# EAGLE design avga_final (EAGLE 7.5.0)
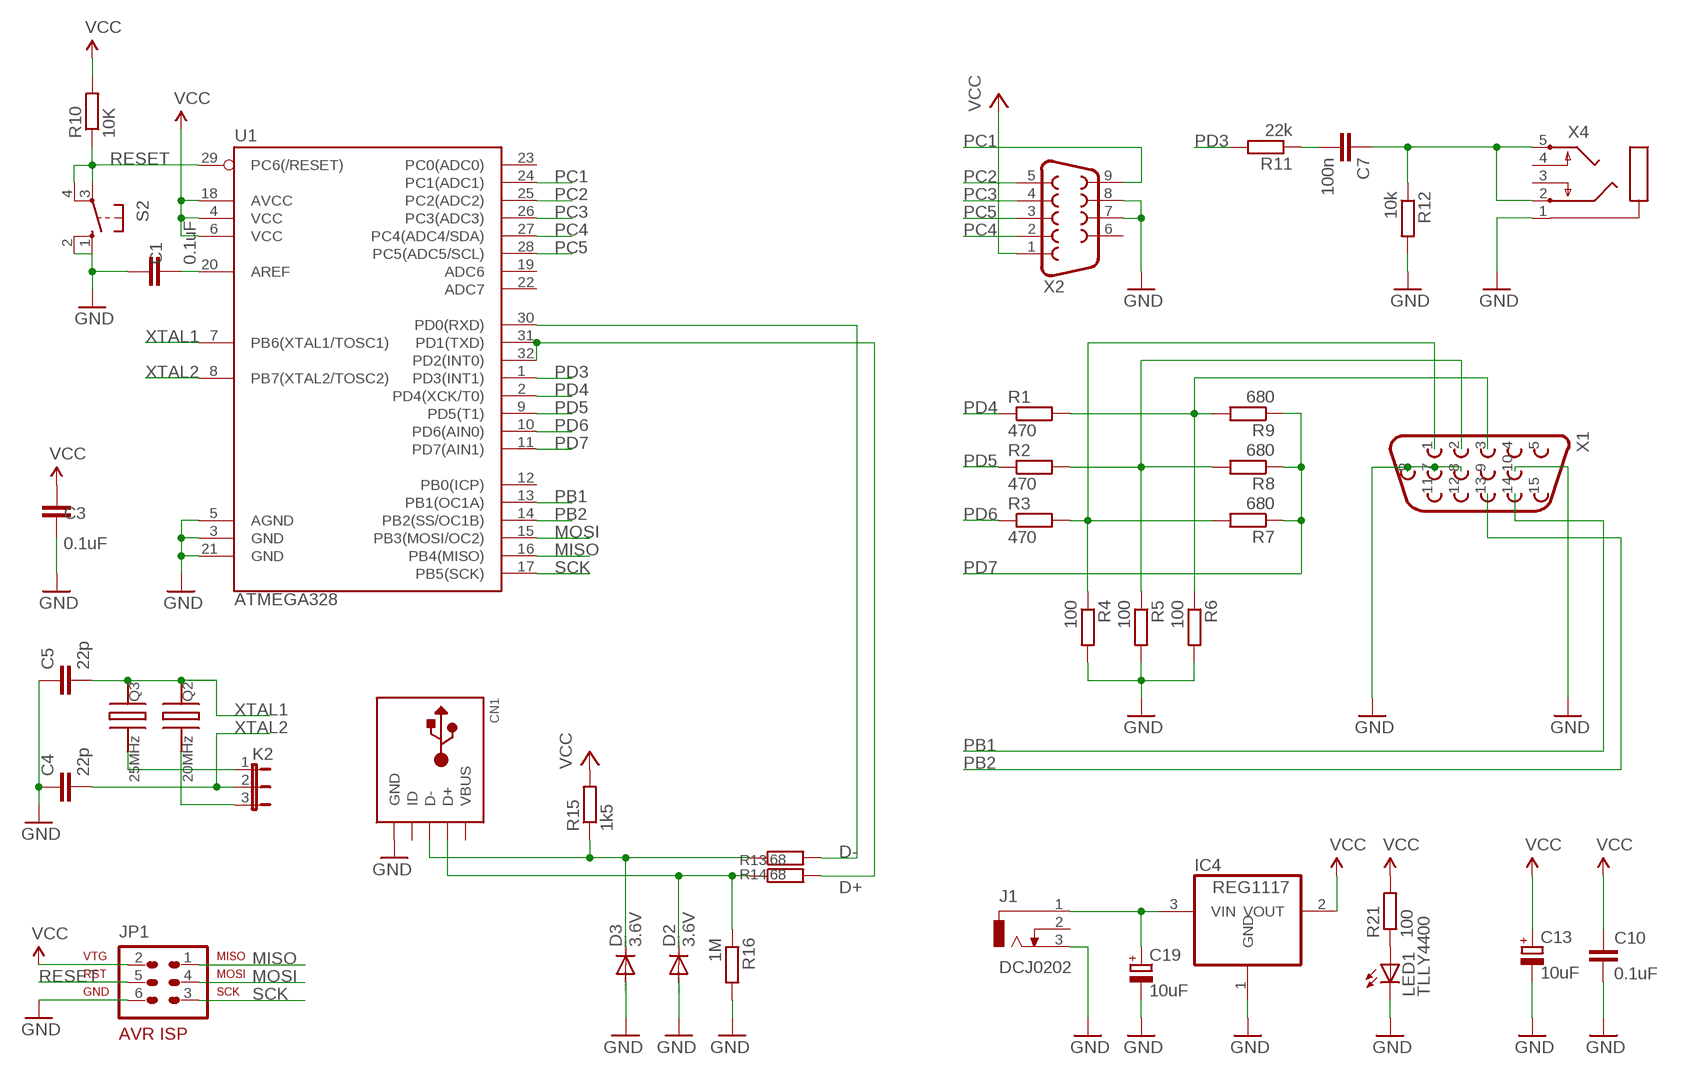
[diagram p0: schematic, sheet 1]

## Parts
C1  0.1uF  C-EUC0805  [C0805]
C3  0.1uF  C-EUC0805  [C0805]
C4  22p  C-EUC0805  [C0805]
C5  22p  C-EUC0805  [C0805]
C7  100n  C-EUC0805  [C0805]
C10  0.1uF  C-EUC0805  [C0805]
C13  10uF  CPOL-EUE2.5-5  [E2,5-5]
C19  10uF  CPOL-EUE2.5-5  [E2,5-5]
CN1  USBMINIB  [USB-MINIB]
D2  3.6V  DIODE-MINIMELF  [MINIMELF]
D3  3.6V  DIODE-MINIMELF  [MINIMELF]
IC4  REG1117  [SOT223]
J1  DCJ0202  [DCJ0202]
JP1  AVR-ISP-6R  [AVR-ISP-6R]
K2  CON-3-POL  [MOLEX-PSK-03]
LED1  TLLY4400  [LED3MM]
Q2  20MHz  QUARZ  [QUARZ]
Q3  25MHz  QUARZ  [QUARZ]
R1  470  R-EU_R0805  [R0805]
R2  470  R-EU_R0805  [R0805]
R3  470  R-EU_R0805  [R0805]
R4  100  R-EU_R0805  [R0805]
R5  100  R-EU_R0805  [R0805]
R6  100  R-EU_R0805  [R0805]
R7  680  R-EU_R0805  [R0805]
R8  680  R-EU_R0805  [R0805]
R9  680  R-EU_R0805  [R0805]
R10  10K  R-EU_R0805  [R0805]
R11  22k  R-EU_R0805  [R0805]
R12  10k  R-EU_R0805  [R0805]
R13  68  R-EU_R0805  [R0805]
R14  68  R-EU_R0805  [R0805]
R15  1k5  R-EU_R0805  [R0805]
R16  1M  R-EU_R0805  [R0805]
R21  100  R-EU_R0805  [R0805]
S2  10-XX  [B3F-10XX]
U1  ATMEGA328  ATMEGA168  [TQFP32-08]
X1  VGA-BU-15POL  [VGA-BU-15POL]
X2  D-SUB-ST-9POL  [M09HP]
X4  KLINKENBUCHSE  [KLINKENBUCHSE]

## Nets
B: R1.2 R6.1 R9.2 X1.3
G: R2.2 R5.1 R8.2 X1.2
GND: C1.2 C3.1 C4.1 C5.1 C10.2 C13.- C19.- CN1.GND D2.A D3.A IC4.1(GND) J1.3 JP1.6 LED1.K(C) R4.2 R5.2 R6.2 R12.2 R16.2 S2.1(S) S2.2(S1) U1.3(GND) U1.5(AGND) U1.21(GND) X1.6 X1.7 X1.8 X1.10 X2.7 X2.8 X4.1
MISO: JP1.1 U1.16(PB4(MISO))
MOSI: JP1.4 U1.15(PB3(MOSI/OC2))
N$1: LED1.A R21.1
N$2: C7.1 R12.1 X4.2 X4.5
N$3: K2.1 Q3.2
N$6: C1.1 U1.20(AREF)
N$11: CN1.D+ D2.C R13.1 R16.1
N$13: CN1.D- D3.C R14.1 R15.1
N$14: C7.2 R11.1
N$15: R13.2 U1.31(PD1(TXD)) U1.32(PD2(INT0))
N$16: R14.2 U1.30(PD0(RXD))
N$19: K2.3 Q2.2
PB1: U1.13(PB1(OC1A)) X1.14
PB2: U1.14(PB2(SS/OC1B)) X1.13
PC1: U1.24(PC1(ADC1)) X2.9
PC2: U1.25(PC2(ADC2)) X2.5
PC3: U1.26(PC3(ADC3)) X2.4
PC4: U1.27(PC4(ADC4/SDA)) X2.2
PC5: U1.28(PC5(ADC5/SCL)) X2.3
PD3: R11.2 U1.1(PD3(INT1))
PD4: R1.1 U1.2(PD4(XCK/T0))
PD5: R2.1 U1.9(PD5(T1))
PD6: R3.1 U1.10(PD6(AIN0))
PD7: R7.1 R8.1 R9.1 U1.11(PD7(AIN1))
R: R3.2 R4.1 R7.2 X1.1
RESET: JP1.5 R10.1 S2.3(P) S2.4(P1) U1.29(PC6(/RESET))
SCK: JP1.3 U1.17(PB5(SCK))
VCC: C3.2 C10.1 C13.+ IC4.2(VOUT) JP1.2 R10.2 R15.2 R21.2 U1.4(VCC) U1.6(VCC) U1.18(AVCC) X2.1
VIN [vcc]: C19.+ IC4.3(VIN) J1.1
XTAL1: C5.2 Q2.1 Q3.1 U1.7(PB6(XTAL1/TOSC1))
XTAL2: C4.2 K2.2 U1.8(PB7(XTAL2/TOSC2))
Unconnected: CN1.ID J1.2 U1.12(PB0(ICP)) U1.19(ADC6) U1.22(ADC7) U1.23(PC0(ADC0)) X1.4 X1.5 X1.9 X1.11 X1.12 X1.15 X2.6 X4.3 X4.4

## Notes on the sheet
- D-
- D+

## Power pins joined to a net without a drawn wire
VBUS: CN1.VBUS

## Library data of the parts
C1 C3 = resistor:C-EU: CAPACITOR, European symbol
C4 C5 C7 C10 = rcl:C-EU: CAPACITOR, European symbol
C13 C19 = rcl:CPOL-EU: POLARIZED CAPACITOR, European symbol
CN1 = adafruit:USB: USB Connectors USBMINIB - Surface Mount Female Mini-B USB Connector 4UConnector: 06564 By microbuilder.eu Thru-hole RA Female Mini-B USB Connector 4UConnector: 18732 By ladyada.net
D2 D3 = diode:DIODE-: DIODE
IC4 = burr-brown:REG1117: 800mA and 1A Low Dropout (LDO) Positive Regulator 1.8V, 2.5V, 2.85V, 3.3V, 5V, and Adj; MPN: REG1117; OC_FARNELL: 1097566; OC_NEWARK: 14P6981
J1 = con-jack-igi:DCJ0202: DC POWER JACK Source: DCJ0202.pdf; OC_FARNELL: unknown; OC_NEWARK: unknown
JP1 = avr-6:AVR-ISP-6: AVR ISP-6 Serial Programming Header
K2 = usbswitchboard:CON-3-POL: JST Stiftleiste B3B-EH-A
LED1 = led-igi:TLLY4400: Low Current (2mA) LED 3 mm Tinted Diffused Package color YELLOW Source: Data sheet <http://www.farnell.com/datasheets/391098.pdf>; MF: VISHAY SEMICONDUCTOR; OC_FARNELL: 1612439
Q2 Q3 = pacman:QUARZ: Quarz
R1-R9 R11-R16 = rcl:R-EU_: RESISTOR, European symbol
R10 R21 = resistor:R-EU_: RESISTOR, European symbol
S2 = switch-omron:10-XX: OMRON SWITCH; MPN: B3F-1000; OC_FARNELL: 176432; OC_NEWARK: 36M3542
U1 = SparkFun:ATMEGA168
X1 = usbboard:VGA-BU-15POL: VGA-Buchse 15pol
X2 = pacman:D-SUB-ST-9POL: D-SUB-Stecker, 9-polig, gewinkelt, RM 9,4
X4 = usbboard:KLINKENBUCHSE: Klinkenbuchse 3,5mm stereo

## Net classes
1 vcc: width 0.254 mm

## Board
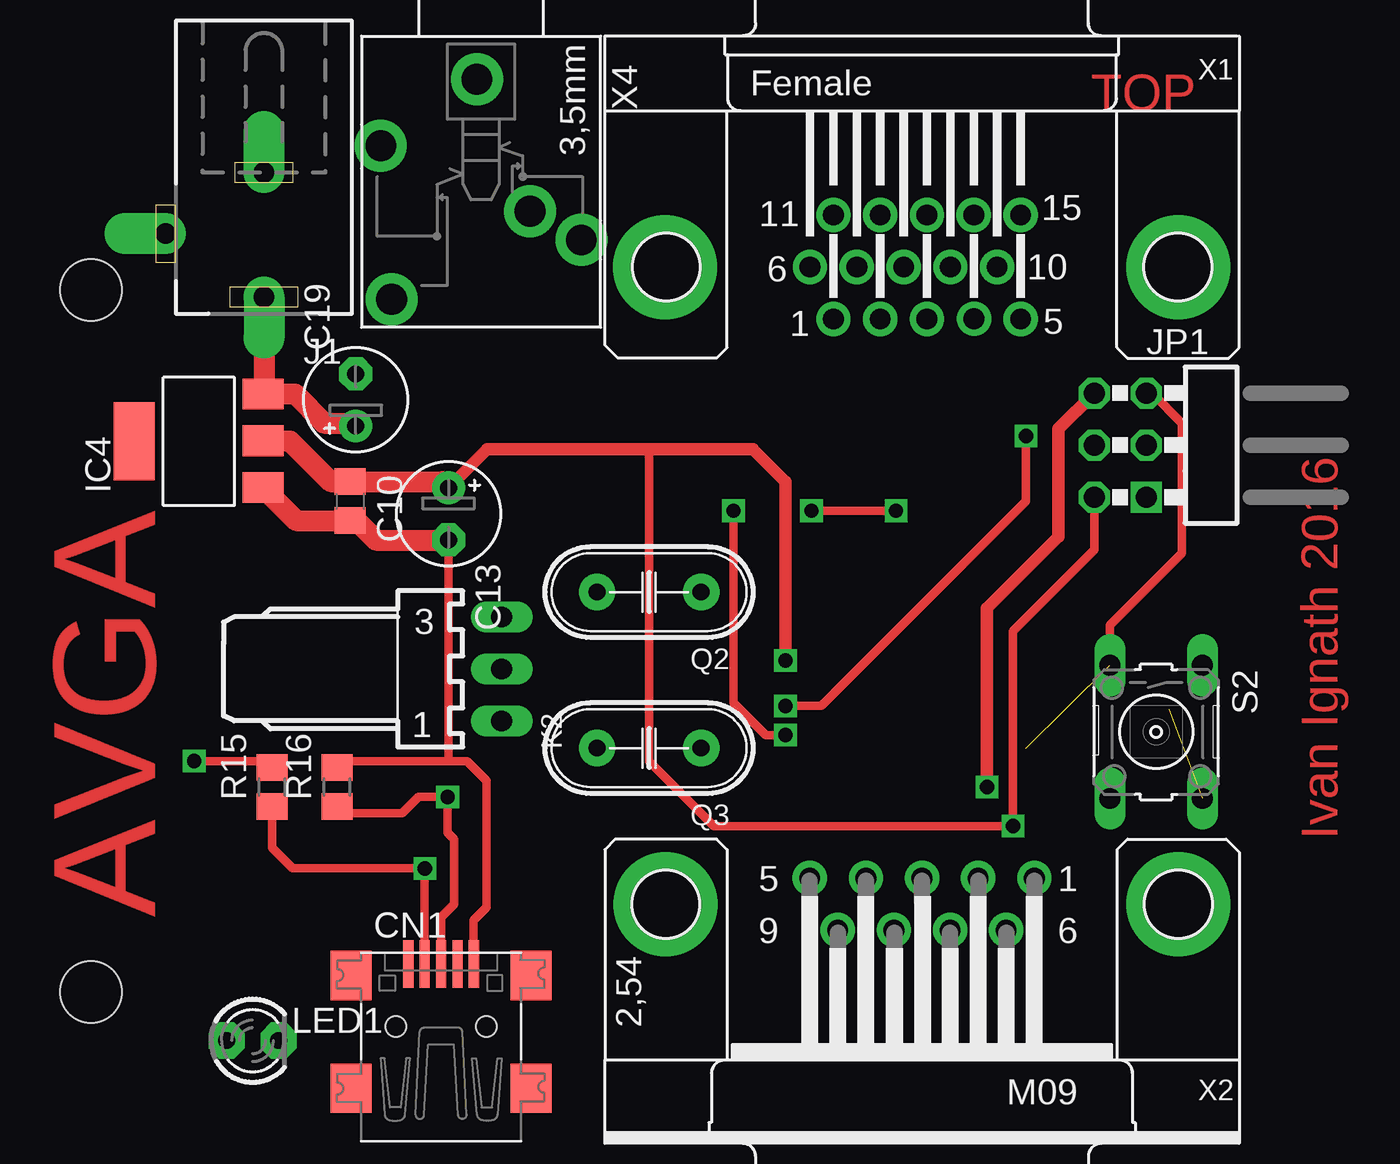
[diagram p1: board, top side]
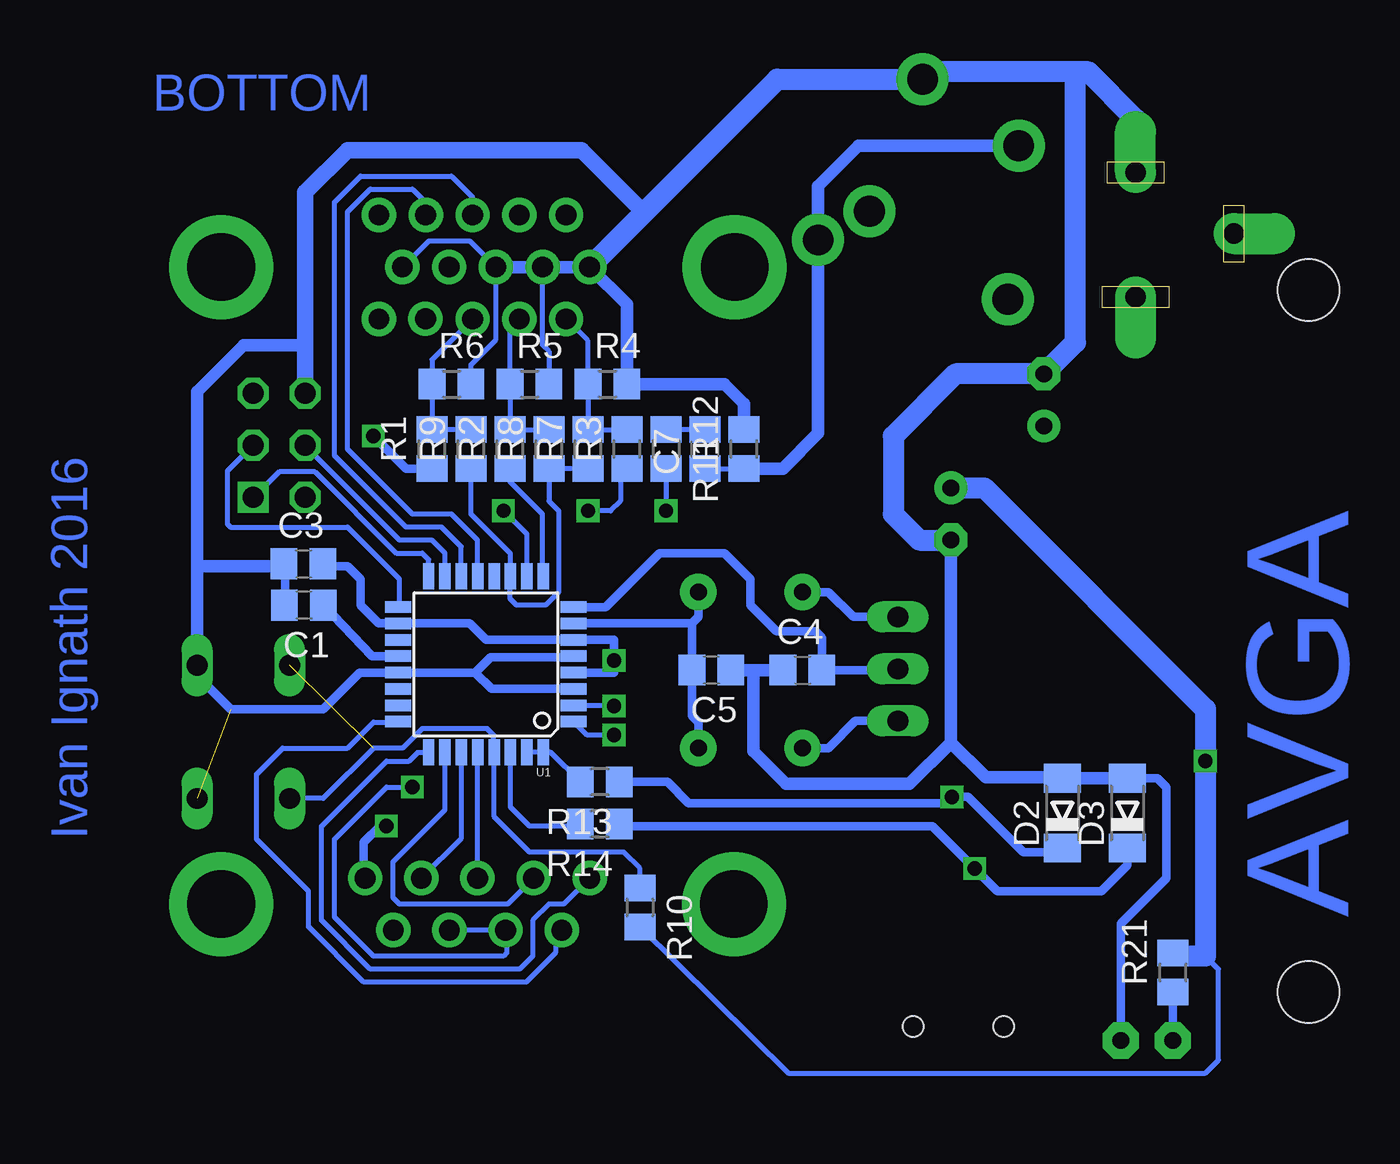
[diagram p2: board, bottom side, seen from below]

No outline drawn. Coordinates in mm, seen from the top.
Copper layers (1*16): Top 0.035mm / dielectric 1.5mm / Bottom 0.035mm
Design rules "default": minimum track width 10mil, minimum drill 24mil, track to track 8mil, track to pad 8mil, pad to pad 8mil, via to via 8mil, smd to smd 8mil, copper to edge 40mil, drill to drill 8mil, minimum pad ring 10mil, minimum via ring 8mil, stop-mask expansion 4mil, vias tented up to drill 0mil, thermal gap 10mil
Holes 3 mm at 77.77,5.87 3.86,5.87 77.77,40.16 3.86,40.16

### Footprints (pad centres in the part's own frame; a part is rotated, then mirrored left to right if it is on the bottom)
C0805 = smd 1.3 x 1.5: 1 -0.95,0; 2 0.95,0
E2,5-5 = drill 0.813 pad 1.6: + -1.27,0 | drill 0.813 pad 1.6 octagon: - 1.27,0
USB-MINIB = smd 0.5 x 2.308: D+ 0,4.064; D- -0.8,4.064; GND 1.6,4.064; ID 0.8,4.064; VBUS -1.6,4.064 | smd 2 x 2.4: GND1 -4.4,-2; GND2 -4.4,3.5; GND3 4.4,3.5; GND4 4.4,-2 | hole 1: -2.2,1; 2.2,1
MINIMELF = smd 1.4 x 1.8: A 1.7,0; C -1.7,0
SOT223 = smd 1.499 x 2.007: 1 -2.261,-3.15; 2 0.025,-3.15; 3 2.311,-3.15 | smd 3.81 x 2.007: 4 0,3.15
DCJ0202 = drill 1 pad 2 offset: 1 0,3.1; 2 4.8,0; 3 0,-3
AVR-ISP-6R = drill 1.016 square: 1 -2.54,-1.27 | drill 1.016 octagon: 2 -2.54,1.27; 3 0,-1.27; 4 0,1.27; 5 2.54,-1.27; 6 2.54,1.27
MOLEX-PSK-03 = drill 1.016 long: 1 2.54,0; 2 0,0; 3 -2.54,0
LED3MM = drill 0.813 pad 1.778 octagon: A -1.27,0; K 1.27,0
QUARZ = drill 0.813 pad 1.778: 1 0,0; 2 5.08,0
R0805 = smd 1.3 x 1.5: 1 -0.95,0; 2 0.95,0
B3F-10XX = drill 1.016 long: 1 -3.251,2.261; 2 3.251,2.261; 3 -3.251,-2.261; 4 3.251,-2.261
TQFP32-08 = smd 1.27 x 0.559: 1 -4.293,2.8; 2 -4.293,2; 3 -4.293,1.2; 4 -4.293,0.4; 5 -4.293,-0.4; 6 -4.293,-1.2; 7 -4.293,-2; 8 -4.293,-2.8; 17 4.293,-2.8; 18 4.293,-2; 19 4.293,-1.2; 20 4.293,-0.4; 21 4.293,0.4; 22 4.293,1.2; 23 4.293,2; 24 4.293,2.8 | smd 0.559 x 1.27: 9 -2.8,-4.293; 10 -2,-4.293; 11 -1.2,-4.293; 12 -0.4,-4.293; 13 0.4,-4.293; 14 1.2,-4.293; 15 2,-4.293; 16 2.8,-4.293; 25 2.8,4.293; 26 2,4.293; 27 1.2,4.293; 28 0.4,4.293; 29 -0.4,4.293; 30 -1.2,4.293; 31 -2,4.293; 32 -2.8,4.293
VGA-BU-15POL = drill 1.016 pad 1.676: 1 4.329,2.54; 2 2.043,2.54; 3 -0.243,2.54; 4 -2.54,2.529; 5 -4.815,2.54; 6 5.472,0; 7 3.186,0; 8 0.9,0; 9 -1.386,0; 10 -3.672,0; 11 4.329,-2.54; 12 2.043,-2.54; 13 -0.243,-2.54; 14 -2.529,-2.54; 15 -4.815,-2.54 | drill 3.302 pad 5.08: G1 -12.522,0; G3 12.56,0
M09HP = drill 1.016 pad 1.676: 1 -5.486,-1.27; 2 -2.743,-1.27; 3 0,-1.27; 4 2.743,-1.27; 5 5.486,-1.27; 6 -4.115,1.27; 7 -1.372,1.27; 8 1.372,1.27; 9 4.115,1.27 | drill 3.302 pad 5.08: G1 -12.522,0; G2 12.522,0
KLINKENBUCHSE = drill 1.499 pad 2.54: 1 -5.004,-0.203; 2 2.845,4.902; 3 1.448,2.388; 4 5.74,-4.369; 5 -1.753,-4.902

### Placement (x,y rotation side)
C1  52.93,24.76 180 bottom
C3  52.95,26.78 0 bottom
C4  28.57,21.59 0 bottom
C5  33.02,21.59 180 bottom
C7  33.34,32.38 90 bottom
C10  16.51,29.84 270 top
C13  21.32,29.22 270 top
C19  16.78,34.79 90 top
CN1  20.95,3.17 0 top
D2  15.88,14.61 90 bottom
D3  12.7,14.61 90 bottom
IC4  9.12,32.76 90 top
J1  12.3,42.9 180 top
JP1  54.13,32.57 90 top
K2  23.92,21.64 270 top
LED1  11.75,3.49 0 top
Q2  33.66,25.4 180 top
Q3  33.66,17.78 180 top
R1  46.67,32.38 90 bottom
R2  42.86,32.38 90 bottom
R3  37.15,32.38 90 bottom
R4  38.1,35.56 0 bottom
R5  41.91,35.56 0 bottom
R6  45.72,35.56 0 bottom
R7  39.05,32.38 90 bottom
R8  40.96,32.38 90 bottom
R9  44.77,32.38 90 bottom
R10  36.51,10 270 bottom
R11  35.24,32.38 270 bottom
R12  31.43,32.38 90 bottom
R13  38.48,16.13 180 bottom
R14  38.47,14.07 180 bottom
R15  12.7,15.88 90 top
R16  15.88,15.88 90 top
R21  10.48,6.83 90 bottom
S2  55.89,18.57 270 top
U1  44.04,21.87 180 bottom
X1  44.45,41.27 180 top
X2  44.45,10.16 180 top
X4  22.91,45.44 270 top

### Tracks (layer width: path | path; a pad name or v marks a point on that pad's centre or on a via)
B
  Bottom 0.254: R9.2 R1.2 R6.1 46.67,36.76 X1.3
G
  Bottom 0.254: R8.2 R2.2 R5.1 42.86,38.28 X1.2
GND  (via drill 0.7 pad 0.25)  (1 unrouted)
  Top 0.406: R16.2 16.2,17.14 21.32,17.14 | CN1.GND 22.54,7.25 22.54,9.37 23.18,10 23.18,16.19 22.23,17.14 21.32,17.14 | 21.32,17.14 C13.-
  Top 0.61: JP1.6 51.12,33.37 51.12,28.1 47.62,24.61 v47.62,15.88
  Top 1.016: C13.- 21.31,27.94 17.78,27.94 16.82,28.89 C10.2 13.88,28.89 IC4.1
  Bottom 0.254: R5.2 40.96,37.15 41.27,37.47 41.27,41.26 X1.7 | R4.2 37.31,35.72 | X1.10 48.1,41.27 46.83,42.55 44.82,42.55 X1.8 43.55,37.73 44.77,36.51 R6.2 | R12.2 31.11,33.65 | X2.7 X2.8 43.02,8.83 43.02,7.78 43.18,7.62 49.53,7.62 51.44,9.53 51.44,13.34 48.9,15.88 v47.62,15.88 | U1.5 39.79,22.23 | 30.96,21.59 C5.1
  Bottom 0.406: 39.79,22.23 43.81,22.23 44.57,21.47 | 44.57,21.47 U1.21 50.2,21.47 51.99,19.68 56.52,19.68 58.15,21.32 S2.1 | U1.3 43.77,20.67 44.57,21.47 | C3.1 53.8,24.78 C1.2 53.82,24.72 | D3.A 11.22,16.3 10.79,15.88 10.79,11.43 13.02,9.21 LED1.K
  Bottom 0.61: C4.1 30.96,21.59 | 32.38,21.59 30.96,21.59 | 30.96,21.59 30.96,17.62 29.37,16.03 23.34,16.03 21.32,18.05 | 21.32,18.05 C13.- | R12.2 31.43,34.61 32.38,35.56 R4.2 37.15,39.45 X1.6 X1.7 X1.8 | D3.A D2.A 15.92,16.35 19.62,16.35 21.32,18.05 | 52.86,37.47 55.88,37.47 58.15,35.2 58.15,26.67 | 58.15,26.67 S2.1 | C3.1 53.91,26.67 58.15,26.67
  Bottom 0.813: JP1.6 52.86,37.47 52.86,44.93 50.8,46.99 39.37,46.99 36.32,43.94
  Bottom 1.016: 12.52,45.9 J1.3 12.3,48.49 14.61,50.8 15.24,50.8 | 15.24,50.8 22.35,50.8 X4.1 29.8,50.45 36.32,43.94 X1.6 | C13.- 22.86,27.94 24.13,29.21 24.13,33.02 21.09,36.06 C19.- 15.24,37.6 15.24,50.8
MISO
  Bottom 0.254: U1.16 46.83,26.99 47.15,27.3 48.42,27.3 52.39,31.27 54.13,31.27 55.37,30.03 JP1.1
MOSI
  Bottom 0.254: U1.15 46.04,27.3 46.67,27.94 48.26,27.94 52.86,32.54 JP1.4
N$1
  Bottom 0.406: LED1.A R21.1
N$2
  Bottom 0.254: C7.1 R12.1
  Bottom 0.61: X4.5 25.83,47.2 27.81,45.21 X4.2 27.81,33.15 29.52,31.43 R12.1
N$3
  Bottom 0.406: K2.1 25.98,19.1 27.3,17.78 Q3.2
N$6
  Bottom 0.406: U1.20 49.59,22.27 C1.1
N$11  (via drill 0.7 pad 0.25)
  Top 0.406: CN1.D+ 20.95,9.53 21.59,10.16 21.59,13.34 21.27,13.65 v21.27,15.4 19.84,15.4 19.05,14.61 16.2,14.61 R16.1
  Bottom 0.254: R13.1 37.27,15.88 | D2.C 16.08,12.7
  Bottom 0.406: 16.08,12.7 17.78,12.7 20.48,15.4 v21.27,15.4 21.27,15.24 21.43,15.08 34.13,15.08 35.17,16.12 R13.1
N$13  (via drill 0.7 pad 0.25)
  Top 0.406: CN1.D- v20.16,11.9 v20.16,11.91 13.7,11.91 D3.C R15.1
  Bottom 0.406: D3.C 12.7,12.06 13.97,10.79 19.05,10.79 v20.16,11.91 22.23,13.97 37.42,13.97 R14.1
N$14
  Bottom 0.254: C7.2 R11.1
N$15
  Bottom 0.254: R13.2 40.88,17.58 U1.32 U1.31
N$16
  Bottom 0.254: R14.2 39.52,13.97 41.91,13.97 42.84,14.9 U1.30
N$19
  Bottom 0.406: K2.3 26.09,24.18 27.3,25.4 Q2.2
PB1
  Bottom 0.254: X1.14 46.98,44.44 47.62,45.09 49.69,45.09 50.8,43.97 50.8,32.38 47.62,29.21 45.72,29.21 44.45,27.94 44.45,26.17 U1.13
PB2
  Bottom 0.254: X1.13 44.69,44.69 45.72,45.72 50.16,45.72 51.44,44.45 51.44,32.07 47.94,28.57 46.2,28.57 45.24,27.62 U1.14
PC1
  Bottom 0.254: X2.9 40.64,8.59 40.64,7.78 42.07,6.35 50.01,6.35 52.7,9.05 52.7,10.79 55.24,13.34 55.24,16.51 53.98,17.78 50.8,17.78 49.53,19.05 48.35,19.05 U1.24
PC2
  Bottom 0.254: X2.5 40.23,10.16 40.96,10.16 41.75,9.37 41.75,7.62 42.39,6.99 49.69,6.99 52.07,9.37 52.07,13.97 48.9,17.14 47.78,17.14 47.35,17.58 U1.25
PC3
  Bottom 0.254: X2.4 42.98,10.16 48.26,10.16 48.58,10.48 48.58,12.22 46.04,14.76 U1.26
PC4
  Bottom 0.254: X2.2 45.24,13.38 U1.27
PC5
  Bottom 0.254: X2.3 44.44,11.44 U1.28
PD3  (via drill 0.7 pad 0.25)
  Top 0.406: v35.24,29.37 35.24,20 36.83,18.41 v37.78,18.41
  Bottom 0.254: R11.2 v35.24,29.37 | v37.78,18.41 39.09,18.41 U1.1
PD4  (via drill 0.7 pad 0.25)
  Top 0.406: v37.78,19.84 39.53,19.84 49.53,29.84 v49.53,33.02
  Bottom 0.254: v37.78,19.84 39.72,19.84 U1.2
  Bottom 0.406: v49.53,33.02 47.95,31.43 R1.1
PD5
  Bottom 0.254: U1.9 41.27,26.2 41.27,29.21 42.86,30.8 R2.1
PD6  (via drill 0.7 pad 0.25)
  Top 0.406: v39.05,29.37 v43.18,29.37
  Bottom 0.254: U1.10 42.04,28.23 v43.18,29.37 | R3.1 37.47,31.12 37.47,29.84 37.94,29.37 v39.05,29.37
PD7
  Bottom 0.254: R7.1 R8.1 40.96,29.84 40.48,29.37 40.48,25.4 41.12,24.77 42.55,24.77 42.86,25.08 42.86,26.14 U1.11 42.84,27.28 44.77,29.21 R9.1
R
  Bottom 0.254: R3.2 R7.2 R4.1 39.05,37.67 X1.1
RESET  (1 unrouted)
  Top 0.406: S2.3 53.63,23.78 57.15,27.3 57.15,33.66 55.69,35.11 JP1.5
  Bottom 0.254: R10.1 36.51,11.91 37.31,12.7 41.91,12.7 43.64,14.43 U1.29 43.66,17.59 43.66,18.41 43.97,18.73 47.15,18.73 48.1,17.78 49.53,17.78 51.99,15.32 S2.4
SCK
  Bottom 0.254: JP1.3 56.67,31.3 56.67,28.73 56.52,28.57 50.8,28.57 48.26,26.04 48.26,24.74 U1.17
VCC  (via drill 0.7 pad 0.25)
  Top 0.406: 31.11,32.38 31.11,17.14 34.29,13.97 v48.9,13.97 48.9,23.5 52.86,27.46 JP1.2 | 12.38,17.14 v8.89,17.14
  Top 0.61: R15.2 12.38,17.14 | C13.+ 23.21,32.38 31.11,32.38 36.2,32.38 37.78,30.8 v37.78,22.07
  Top 1.016: C13.+ 21.02,30.8 C10.1 15.56,30.8 13.57,32.79 IC4.2
  Bottom 0.254: R10.2 29.27,1.91 8.89,1.91 8.26,2.54 8.26,6.99 8.89,7.62
  Bottom 0.406: X2.1 50.01,11.5 50.01,13.18 49.21,13.97 v48.9,13.97 | U1.4 37.78,21.47 v37.78,22.07 37.78,23.07 U1.6 44.02,23.07 44.83,23.87 U1.18 49.27,23.87 50.16,24.77 50.16,26.04 50.8,26.67 51.99,26.67 C3.2
  Bottom 1.016: C13.+ 19.7,30.49 8.89,19.68 8.89,17.78 v8.89,17.14 8.89,7.62 10.42,7.62 R21.2
VIN
  Top 1.016: J1.1 12.3,35.1 IC4.3 13.82,35.07 15.24,33.66 16.64,33.66 C19.+
XTAL1
  Bottom 0.406: U1.7 33.97,23.87 | 33.97,23.87 C5.2 33.97,19.36 33.66,19.05 Q3.1 | Q2.1 33.66,24.18 33.97,23.87
XTAL2
  Bottom 0.406: K2.2 23.97,21.59 C4.2 27.62,23.18 27.94,23.5 29.84,23.5 31.11,24.77 31.11,26.04 32.38,27.3 35.56,27.3 38.2,24.67 U1.8

### Text on the board
Top: TOP | Ivan Ignath 2016 | AVGA
Bottom: BOTTOM | Ivan Ignath 2016 | AVGA